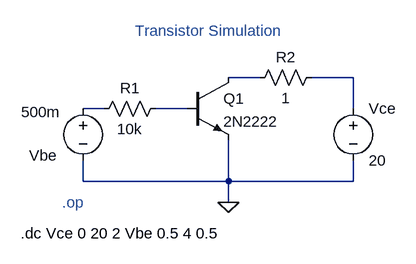
[diagram p0: schematic BJT_Simulation.asc]
BJT_Simulation.asc, the LTspice schematic file:
Version 4.1
SHEET 1 880 680
WIRE 288 112 240 112
WIRE 432 112 368 112
WIRE 48 160 16 160
WIRE 176 160 128 160
WIRE 432 160 432 112
WIRE 16 272 16 240
WIRE 240 272 240 208
WIRE 240 272 16 272
WIRE 432 272 432 240
WIRE 432 272 240 272
WIRE 240 304 240 272
FLAG 240 304 0
SYMBOL npn 176 112 R0
SYMATTR InstName Q1
SYMATTR Value 2N2222
SYMBOL voltage 432 144 R0
WINDOW 123 0 0 Left 0
WINDOW 39 0 0 Left 0
SYMATTR InstName Vce
SYMATTR Value 20
SYMBOL voltage 16 144 R0
WINDOW 0 -83 88 Left 2
WINDOW 3 -95 21 Left 2
WINDOW 123 0 0 Left 0
WINDOW 39 0 0 Left 0
SYMATTR InstName Vbe
SYMATTR Value 500m
SYMBOL res 144 144 R90
WINDOW 0 0 56 VBottom 2
WINDOW 3 32 56 VTop 2
SYMATTR InstName R1
SYMATTR Value 10k
SYMBOL res 384 96 R90
WINDOW 0 0 56 VBottom 2
WINDOW 3 32 56 VTop 2
SYMATTR InstName R2
SYMATTR Value 1
TEXT 96 40 Left 2 ;Transistor Simulation
TEXT -16 304 Left 2 ;.op
TEXT -80 352 Left 2 !.dc Vce 0 20 2 Vbe 0.5 4 0.5

The netlist it stands for:
* BJT_Simulation.asc
Q1 N001 N004 0 0 2N2222
Vce N002 0 20
Vbe N003 0 500m
R1 N004 N003 10k
R2 N002 N001 1
.model NPN NPN
.model PNP PNP
.lib standard.bjt
* Transistor Simulation
* .op
.dc Vce 0 20 2 Vbe 0.5 4 0.5
.backanno
.end